# Altium schematic sheet POWER_1.8V_3A.SchDoc
size A4
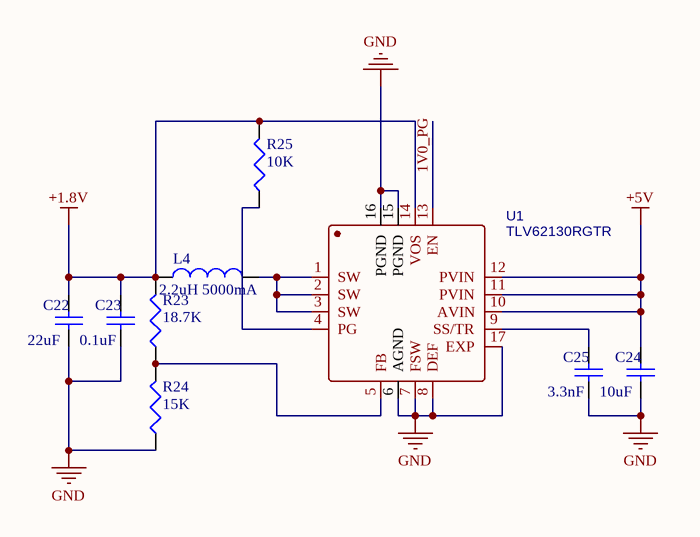
[diagram p0: POWER_1.8V_3A.SchDoc]

## Parts
C22  value 22uF  [C1210]  (hidden comment: Cap Semi)
C23  value 0.1uF  [C1210]  (hidden comment: Cap Semi)
C24  value 10uF  [C1210]  (hidden comment: Cap Semi)
C25  value 3.3nF  [C1210]  (hidden comment: Cap Semi)
L4  value 2.2uH 5000mA  [IND-SMD_L5.5-W5.2]  (hidden comment: Inductor)
R23  value 18.7K  [J1-0603]  (hidden comment: Res3)
R24  value 15K  [J1-0603]  (hidden comment: Res3)
R25  value 10K  [J1-0603]  (hidden comment: Res3)
U1  TLV62130RGTR  [QFN-16]

## Nets
+1.8V: C22.2 C23.2 L4.1 R23.2 R25.2 U1.14(VOS)
+5V: C24.2 U1.10(AVIN) U1.11(PVIN) U1.12(PVIN)
GND: C22.1 C23.1 C24.1 C25.1 R24.1 U1.6(AGND) U1.7(FSW) U1.8(DEF) U1.15(PGND) U1.16(PGND) U1.17(EXP)
1V0_PG: U1.13(EN)
NetC25_2: C25.2 U1.9(SS/TR)
NetL4_2: L4.2 U1.1(SW) U1.2(SW) U1.3(SW)
NetR23_1: R23.1 R24.2 U1.5(FB)
NetR25_1: R25.1 U1.4(PG)

## Library data of the parts
C22-C25 = Cap Semi: Capacitor (Semiconductor SIM Model); Published: 8-Jun-2000; LatestRevisionDate: 29-May-2009; LatestRevisionNote: IPC-7351 Footprint Added.; PackageReference: C1206; Publisher: Altium Limited; PackageDescription: Chip Capacitor
L4 = Inductor: Code_IEC: 1005; Published: 8-Jun-2000; LatestRevisionDate: 29-May-2009; LatestRevisionNote: IPC-7351 Footprint Added.; PackageReference: 0402-A; Publisher: Altium Limited; PackageDescription: Chip Inductor; Code_JEITA: 0402
R23-R25 = Res3: Resistor; Published: 8-Jun-2000; LatestRevisionDate: 29-May-2009; LatestRevisionNote: IPC-7351 Footprint Added.; PackageReference: J1-0603; Publisher: Altium Limited; PackageDescription: Chip Resistor
U1 = TLV62130RGTR: BOM_Manufacturer: TI; Contributor: LCSC; SMT Type: Extend; BOM_Supplier: LCSC; BOM_Manufacturer Part: TLV62130RGTR; BOM_Supplier Part: C122479; BOM_LCSC Assembly: Yes; spicePre: U; spiceSymbolName: TLV62130RGTR